# EAGLE design 130_adapt (EAGLE 6.5.0)
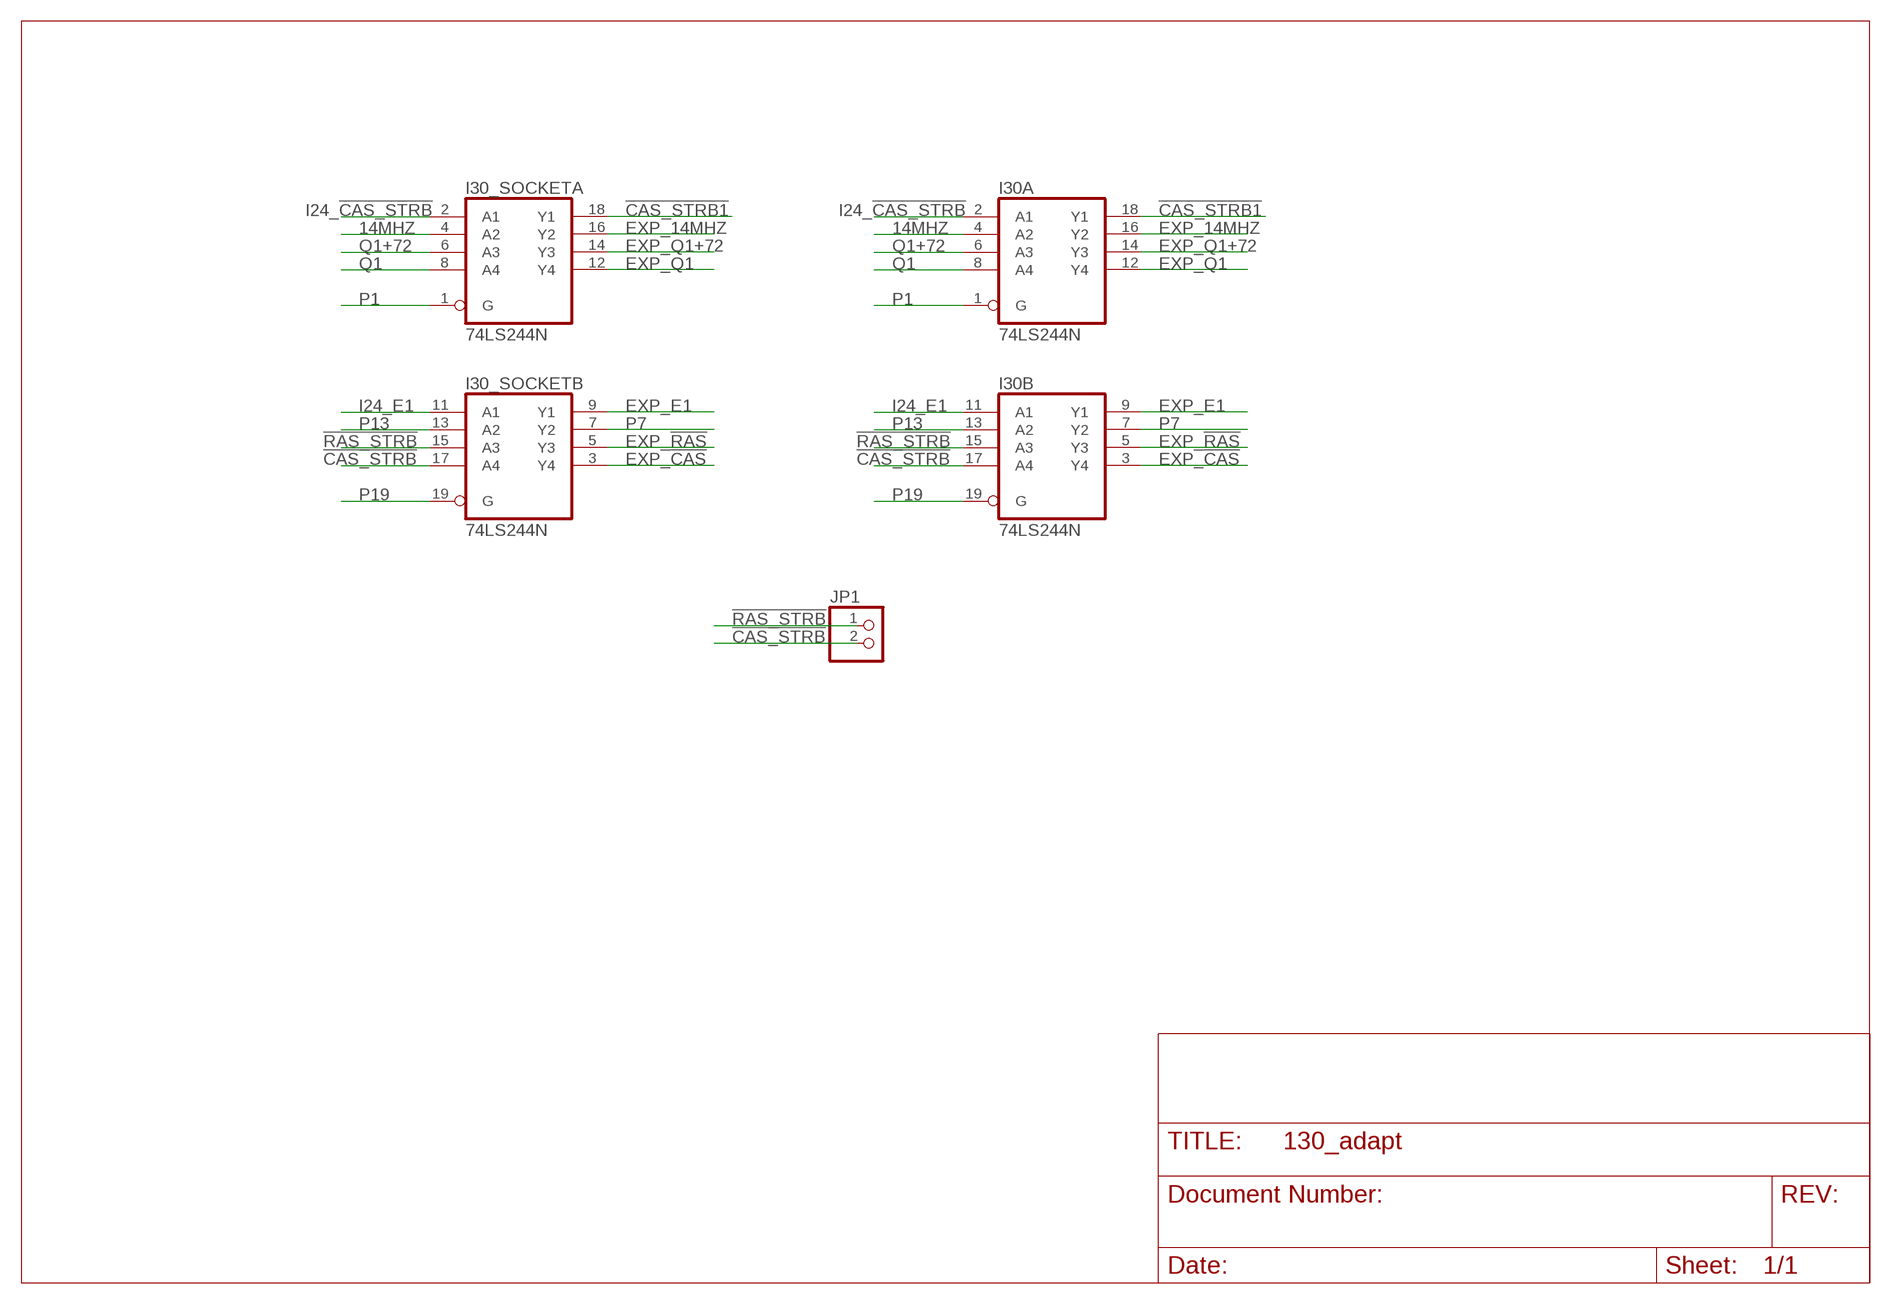
[diagram p0: schematic, sheet 1]

## Parts
I30  74LS244N  [DIL20]
I30_SOCKET  74LS244N  [DIL20]
JP1  PINHD-1X2/90  [1X02/90]

## Nets
14MHZ: I30.4(A:A2) I30_SOCKET.4(A:A2)
!CAS_STRB: I30.17(B:A4) I30_SOCKET.17(B:A4) JP1.2
!CAS_STRB1: I30.18(A:Y1) I30_SOCKET.18(A:Y1)
!RAS_STRB: I30.15(B:A3) I30_SOCKET.15(B:A3) JP1.1
EXP_14MHZ: I30.16(A:Y2) I30_SOCKET.16(A:Y2)
EXP_!CAS: I30.3(B:Y4) I30_SOCKET.3(B:Y4)
EXP_!RAS: I30.5(B:Y3) I30_SOCKET.5(B:Y3)
EXP_E1: I30.9(B:Y1) I30_SOCKET.9(B:Y1)
EXP_Q1: I30.12(A:Y4) I30_SOCKET.12(A:Y4)
EXP_Q1+72: I30.14(A:Y3) I30_SOCKET.14(A:Y3)
I24_!CAS_STRB: I30.2(A:A1) I30_SOCKET.2(A:A1)
I24_E1: I30.11(B:A1) I30_SOCKET.11(B:A1)
P1: I30.1(A:G) I30_SOCKET.1(A:G)
P7: I30.7(B:Y2) I30_SOCKET.7(B:Y2)
P13: I30.13(B:A2) I30_SOCKET.13(B:A2)
P19: I30.19(B:G) I30_SOCKET.19(B:G)
Q1: I30.8(A:A4) I30_SOCKET.8(A:A4)
Q1+72: I30.6(A:A3) I30_SOCKET.6(A:A3)

## Power pins joined to a net without a drawn wire
GND: I30.10(P:GND) I30_SOCKET.10(P:GND)
VCC: I30.20(P:VCC) I30_SOCKET.20(P:VCC)

## Library data of the parts
I30 I30_SOCKET = 74xx-eu-round:74*244: Octal BUFFER and LINE DRIVER, 3-state
JP1 = pinhead-round:PINHD-1X2: PIN HEADER

## Board
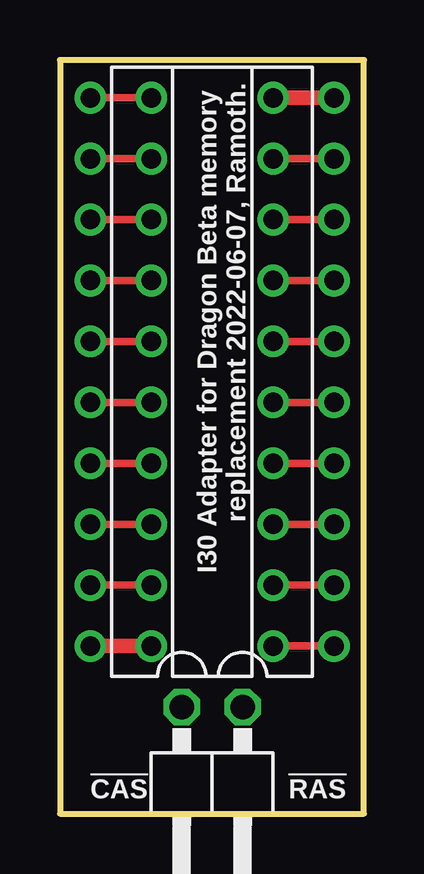
[diagram p1: board, top side]
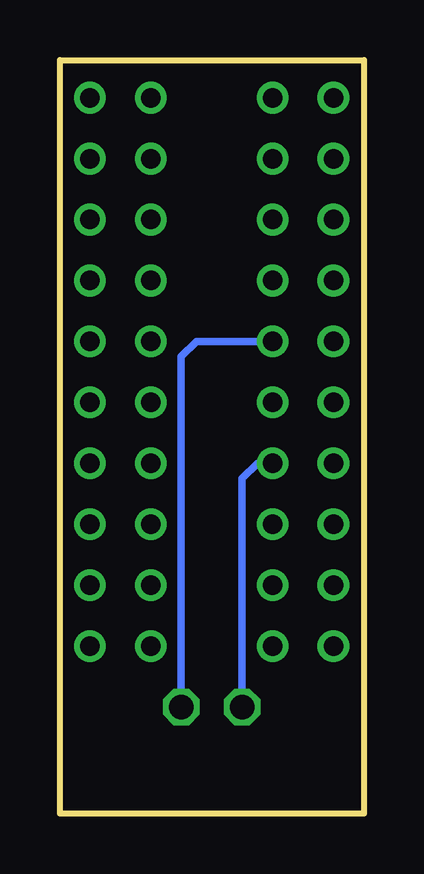
[diagram p2: board, bottom side, seen from below]

Size 12.68 x 31.42 mm. Coordinates in mm from the lower left corner, seen from the top.
Outline: 0,0 12.68,0 12.68,31.42 0,31.42 0,0
Copper layers (1*16): Top 0.035mm / dielectric 1.5mm / Bottom 0.035mm
Design rules "default": minimum track width 10mil, minimum drill 24mil, track to track 8mil, track to pad 8mil, pad to pad 8mil, via to via 8mil, smd to smd 8mil, copper to edge 40mil, drill to drill 8mil, minimum pad ring 10mil, minimum via ring 8mil, stop-mask expansion 4mil, vias tented up to drill 0mil, thermal gap 10mil

### Footprints (pad centres in the part's own frame; a part is rotated, then mirrored left to right if it is on the bottom)
DIL20 = drill 0.813: 1 -11.43,-3.81; 2 -8.89,-3.81; 3 -6.35,-3.81; 4 -3.81,-3.81; 5 -1.27,-3.81; 6 1.27,-3.81; 7 3.81,-3.81; 8 6.35,-3.81; 9 8.89,-3.81; 10 11.43,-3.81; 11 11.43,3.81; 12 8.89,3.81; 13 6.35,3.81; 14 3.81,3.81; 15 1.27,3.81; 16 -1.27,3.81; 17 -3.81,3.81; 18 -6.35,3.81; 19 -8.89,3.81; 20 -11.43,3.81
1X02/90 = drill 1.016 octagon: 1 -1.27,-3.81; 2 1.27,-3.81

### Placement (x,y rotation side)
I30  5.08,18.41 90 top
I30_SOCKET  7.62,18.41 90 top
JP1  6.35,0.64 180 top

### Tracks (layer width: path | path; a pad name or v marks a point on that pad's centre or on a via)
14MHZ
  Top 0.305: I30.4 I30_SOCKET.4
!CAS_STRB
  Top 0.305: I30_SOCKET.17 I30.17
  Bottom 0.305: JP1.2 5.08,13.97 4.45,14.61 I30_SOCKET.17
!CAS_STRB1
  Top 0.305: I30.18 I30_SOCKET.18
!RAS_STRB
  Top 0.305: I30_SOCKET.15 I30.15
  Bottom 0.305: JP1.1 7.62,19.05 6.99,19.68 I30_SOCKET.15
EXP_14MHZ
  Top 0.305: I30.16 I30_SOCKET.16
EXP_!CAS
  Top 0.305: I30_SOCKET.3 I30.3
EXP_!RAS
  Top 0.305: I30_SOCKET.5 I30.5
EXP_E1
  Top 0.305: I30_SOCKET.9 I30.9
EXP_Q1
  Top 0.305: I30.12 I30_SOCKET.12
EXP_Q1+72
  Top 0.305: I30.14 I30_SOCKET.14
GND
  Top 0.61: I30_SOCKET.10 I30.10
I24_!CAS_STRB
  Top 0.305: I30.2 I30_SOCKET.2
I24_E1
  Top 0.305: I30_SOCKET.11 I30.11
P1
  Top 0.305: I30_SOCKET.1 I30.1
P7
  Top 0.305: I30_SOCKET.7 I30.7
P13
  Top 0.305: I30_SOCKET.13 I30.13
P19
  Top 0.305: I30_SOCKET.19 I30.19
Q1
  Top 0.305: I30.8 I30_SOCKET.8
Q1+72
  Top 0.305: I30.6 I30_SOCKET.6
VCC
  Top 0.61: I30_SOCKET.20 I30.20

### Text on the board
tPlace: I30 Adapter for Dragon Beta memory / replacement 2022-06-07, Ramoth. | !CAS | !RAS